# Altium schematic sheet test.SchDoc
size B
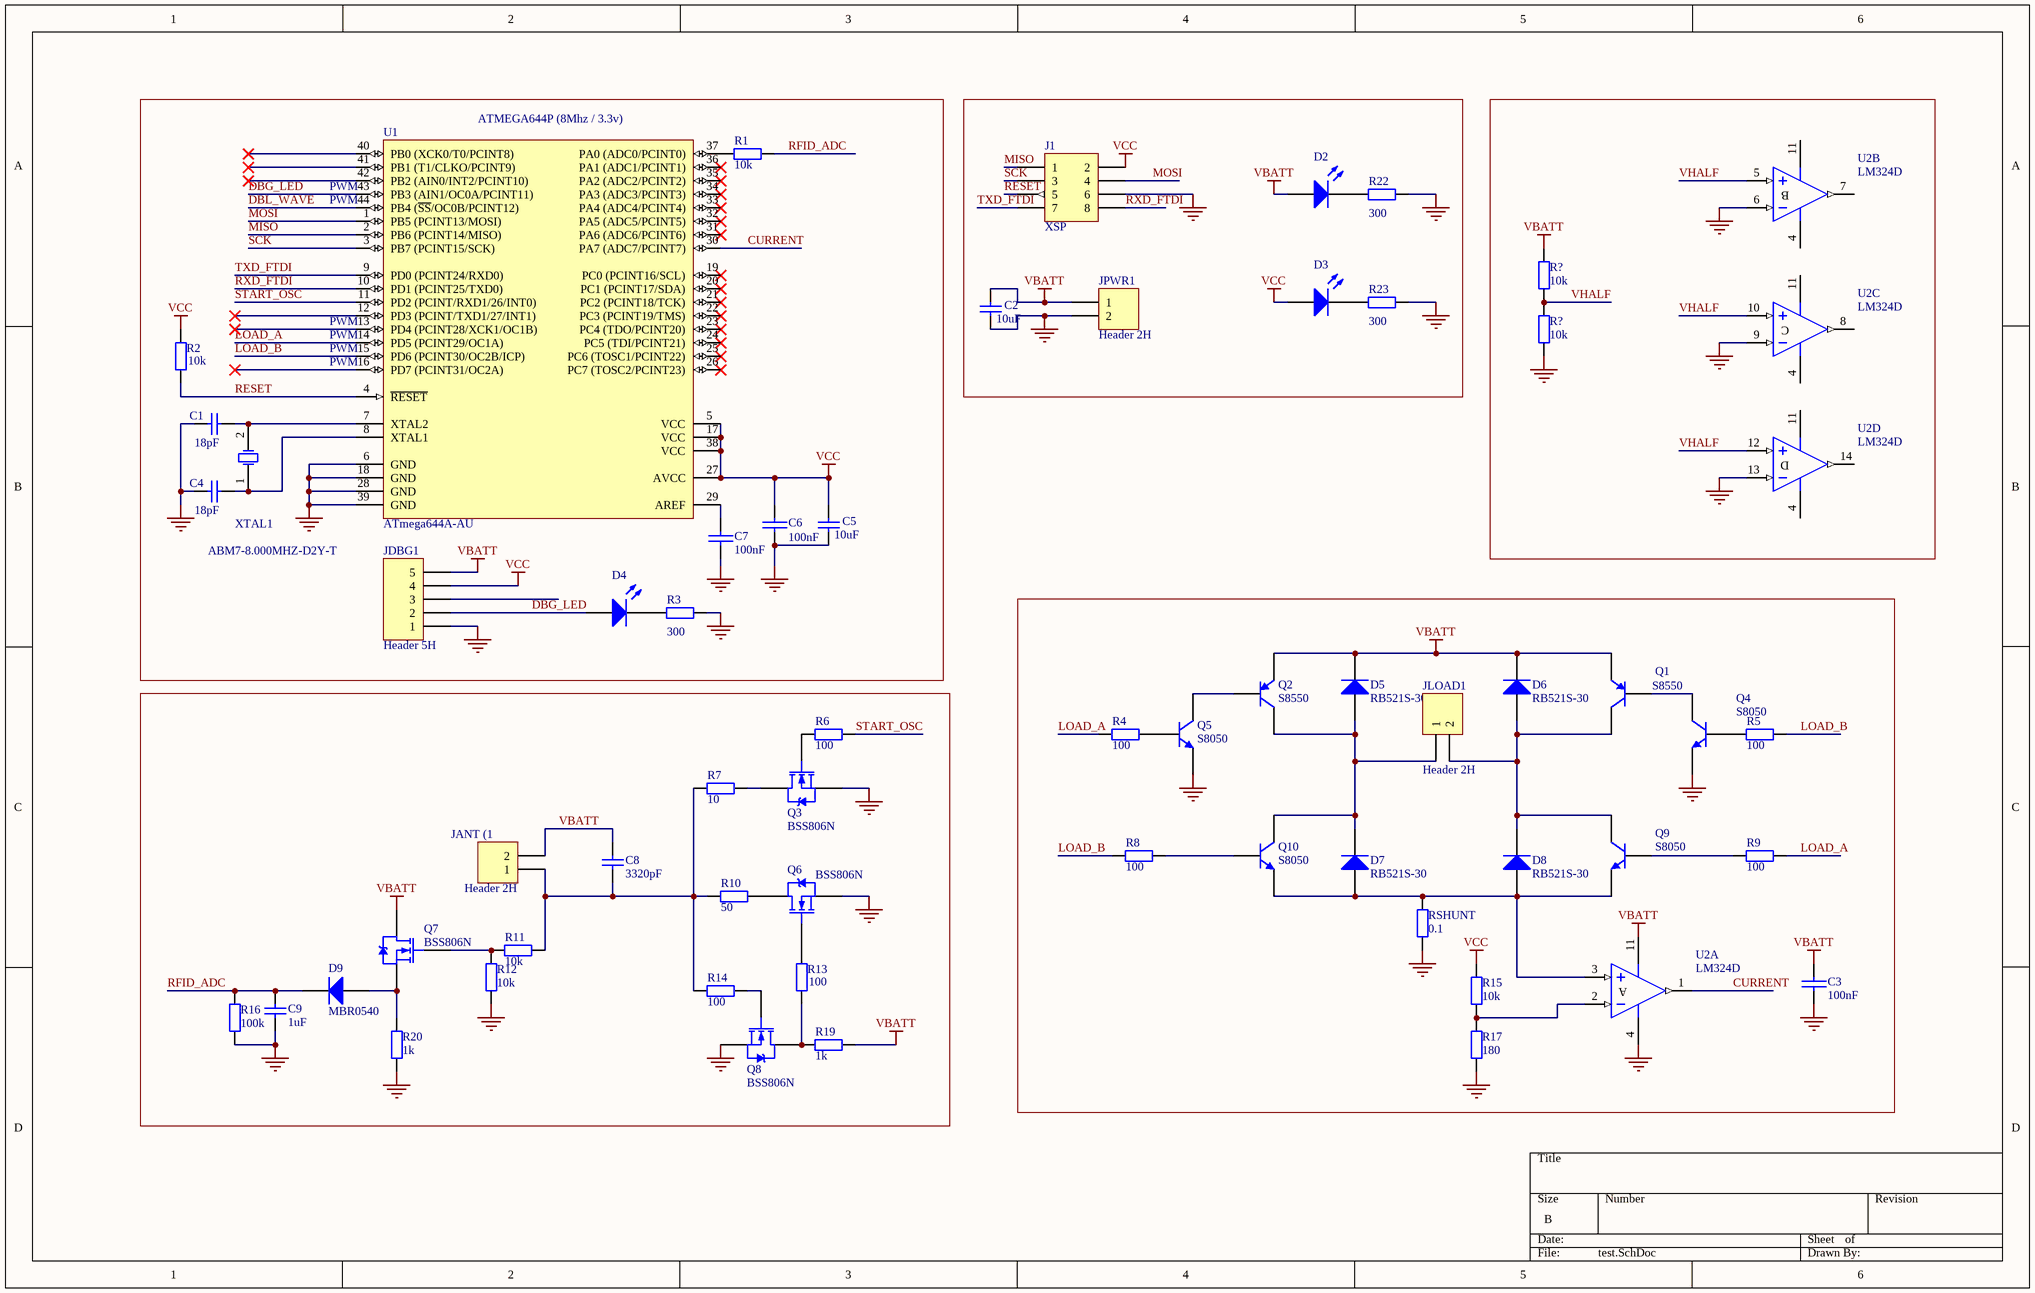
[diagram p0: test.SchDoc]

## Parts
(Parts that share a designator on the sheet are numbered #1, #2 ... from top to bottom, then left to right.)
C1  18pF  [CAPC1608N]
C2  10uF  [CAPC3216L]
C3  100nF  [CAPC1608N]
C4  18pF  [CAPC1608N]
C5  10uF  [CAPC3216L]
C6  100nF  [CAPC1608N]
C7  100nF  [CAPC1608N]
C8  3320pF  [CAPC1608N]
C9  1uF  [CAPC1608N]
D2  (no value)  [CAPC1608N]
D3  (no value)  [CAPC1608N]
D4  (no value)  [CAPC1608N]
D5  RB521S-30
D6  RB521S-30
D7  RB521S-30
D8  RB521S-30
D9  MBR0540  [SOD123/X.85]
J1  XSP  [HDR2X4H]
JANT_(1  Header 2H  [HDR1X2H]
JDBG1  Header 5H  [HDR1X5H]
JLOAD1  Header 2H  [HDR1X2H]
JPWR1  Header 2H  [HDR1X2H]
Q1  S8550  [BCY-W3/E4]
Q2  S8550  [BCY-W3/E4]
Q3  BSS806N  [BSS806N]
Q4  S8050  [BCY-W3/E4]
Q5  S8050  [BCY-W3/E4]
Q6  BSS806N  [BSS806N]
Q7  BSS806N  [BSS806N]
Q8  BSS806N  [BSS806N]
Q9  S8050  [BCY-W3/E4]
Q10  S8050  [BCY-W3/E4]
R1  10k  [RESC1608N]
R2  10k  [RESC1608N]
R3  300  [RESC1608N]
R4  100  [RESC1608N]
R5  100  [RESC1608N]
R6  100  [RESC1608N]
R7  10  [RESC1608N]
R8  100  [RESC1608N]
R9  100  [RESC1608N]
R10  50  [RESC1608N]
R11  10k  [RESC1608N]
R12  10k  [RESC1608N]
R13  100  [RESC1608N]
R14  100  [RESC1608N]
R15  10k  [RESC1608N]
R16  100k  [RESC1608N]
R17  180  [RESC1608N]
R19  1k  [RESC1608N]
R20  1k  [RESC1608N]
R22  300  [RESC1608N]
R23  300  [RESC1608N]
R?#1  10k  [RESC1608N]
R?#2  10k  [RESC1608N]
RSHUNT  0.1  [AXIAL-0.4]
U1  ATmega644A-AU  [44A_N]
U2  LM324D  [SO14_N]  (parts A,B,C,D of 4)
XTAL1  ABM7-8.000MHZ-D2Y-T  [XTAL]

## Nets
GND: C1.1 C2.1 C3.2 C4.1 C5.1 C6.2 C7.2 C9.1 J1.6 JDBG1.1 JPWR1.2 Q3.2(S) Q4.1(E) Q5.1(E) Q6.2(S) Q8.2(S) R3.2 R12.1 R16.1 R17.1 R20.1 R22.2 R23.2 R?#2.1 RSHUNT.1 U1.6(GND) U1.18(GND) U1.28(GND) U1.39(GND) U2.4(V+) U2.6(IN-) U2.9(IN-) U2.13(IN-)
VBATT: C2.2 C3.1 C8.2 D2.1(A) D5.1(K) D6.1(K) JANT_(1.2 JDBG1.5 JPWR1.1 Q1.1(E) Q2.1(E) Q7.3(D) R19.1 R?#1.2 U2.11(V-)
VCC: C5.2 C6.1 D3.1(A) J1.2 JDBG1.4 R2.1 R15.2 U1.5(VCC) U1.17(VCC) U1.27(AVCC) U1.38(VCC)
CURRENT: U1.30(PA7_(ADC7/PCINT7)) U2.1(OUT)
DBG_LED: D4.1(A) JDBG1.2 U1.43(PB3_(AIN1/OC0A/PCINT11))
DBL_WAVE: U1.44(PB4_(~{SS}/OC0B/PCINT12))
LOAD_A: R4.1 R9.2 U1.14(PD5_(PCINT29/OC1A))
LOAD_B: R5.2 R8.1 U1.15(PD6_(PCINT30/OC2B/ICP))
MISO: J1.1 U1.2(PB6_(PCINT14/MISO))
MOSI: J1.4 U1.1(PB5_(PCINT13/MOSI))
RESET: J1.5 R2.2 U1.4(~{RESET})
RFID_ADC: C9.2 D9.1(K) R1.1 R16.2
RXD_FTDI: J1.8 U1.10(PD1_(PCINT25/TXD0))
SCK: J1.3 U1.3(PB7_(PCINT15/SCK))
START_OSC: R6.2 U1.11(PD2_(PCINT/RXD1/26/INT0))
TXD_FTDI: J1.7 U1.9(PD0_(PCINT24/RXD0))
VHALF: R?#1.1 R?#2.2 U2.5(IN+) U2.10(IN+) U2.12(IN+)
NetC1_2: C1.2 U1.7(XTAL2) XTAL1.2(OSC2)
NetC4_2: C4.2 U1.8(XTAL1) XTAL1.1(OSC1)
NetC7_1: C7.1 U1.29(AREF)
NetC8_1: C8.1 JANT_(1.1 R7.1 R10.1 R11.2 R14.1
NetD2_2: D2.2(K) R22.1
NetD3_2: D3.2(K) R23.1
NetD4_2: D4.2(K) R3.1
NetD5_2: D5.2(A) D7.1(K) JLOAD1.1 Q2.3(C) Q10.3(C)
NetD6_2: D6.2(A) D8.1(K) JLOAD1.2 Q1.3(C) Q9.3(C)
NetD7_2: D7.2(A) D8.2(A) Q9.1(E) Q10.1(E) RSHUNT.2 U2.3(IN+)
NetD9_2: D9.2(A) Q7.2(S) R20.2
NetQ1_2: Q1.2(B) Q4.3(C)
NetQ2_2: Q2.2(B) Q5.3(C)
NetQ3_1: Q3.1(G) R6.1
NetQ3_3: Q3.3(D) R7.2
NetQ4_2: Q4.2(B) R5.1
NetQ5_2: Q5.2(B) R4.2
NetQ6_1: Q6.1(G) R13.1
NetQ6_3: Q6.3(D) R10.2
NetQ7_1: Q7.1(G) R11.1 R12.2
NetQ8_1: Q8.1(G) R14.2
NetQ8_3: Q8.3(D) R13.2 R19.2
NetQ9_2: Q9.2(B) R9.1
NetQ10_2: Q10.2(B) R8.2
NetR1_2: R1.2 U1.37(PA0_(ADC0/PCINT0))
NetR15_1: R15.1 R17.2 U2.2(IN-)

Not connected (* = marked no-connect by the designer): JDBG1 3; U1 12(PD3_(PCINT/TXD1/27/INT1))* 13(PD4_(PCINT28/XCK1/OC1B))* 16(PD7_(PCINT31/OC2A))* 19(PC0_(PCINT16/SCL))* 20(PC1_(PCINT17/SDA))* 21(PC2_(PCINT18/TCK))* 22(PC3_(PCINT19/TMS))* 23(PC4_(TDO/PCINT20))* 24(PC5_(TDI/PCINT21))* 25(PC6_(TOSC1/PCINT22))* 26(PC7_(TOSC2/PCINT23))* 31(PA6_(ADC6/PCINT6))* 32(PA5_(ADC5/PCINT5))* 33(PA4_(ADC4/PCINT4))* 34(PA3_(ADC3/PCINT3))* 35(PA2_(ADC2/PCINT2))* 36(PA1_(ADC1/PCINT1))* 40(PB0_(XCK0/T0/PCINT8))* 41(PB1_(T1/CLKO/PCINT9))* 42(PB2_(AIN0/INT2/PCINT10))*; U2 7(OUT) 8(OUT) 14(OUT)

## Notes on the sheet
- (near U1) ATMEGA644P (8Mhz / 3.3v)
- (near U1) PWM
- (in symbol LM324D, part A) A
- (in symbol LM324D, part B) B
- (in symbol LM324D, part C) C
- (in symbol LM324D, part D) D

## Library data of the parts
C1 C2 C4 C5 C8 C9 = Cap: Capacitor; Published: 8-Jun-2000; LatestRevisionDate: 17-Jul-2002; LatestRevisionNote: Re-released for DXP Platform.; PackageReference: RAD-0.3; Publisher: Altium Limited
  C1 C4: Value: 18pF
  C2 C5: PackageDescription: Radial Cap, Thru-Hole; 2 Leads; 0.3 in Pin Spacing; Value: 10uF
  C8: Value: 3320pF
  C9: Value: 1uF
C3 C6 C7 = CAP: Capacitor
D2-D4 = LED3: Typical BLUE SiC LED; Published: 8-Jun-2000; LatestRevisionDate: 17-Dec-2003; LatestRevisionNote: PCB Footprint replaced.; DatasheetVersion: 16-Apr-2002; PackageVersion: 16-Apr-2002; PackageReference: 3.5X2.8X1.9; Publisher: Altium Limited
D5-D9 = Diode: Default Diode; Published: 8-Jun-2000; LatestRevisionDate: 17-Jul-2002; LatestRevisionNote: Re-released for DXP Platform.; PackageVersion: Sep-1996; PackageReference: SMC; Publisher: Altium Limited; Code_JEDEC: DO-214-AB
J1 = Header 4X2H: Header, 4-Pin, Dual row, Right Angle; LatestRevisionDate: 17-Jul-2002; LatestRevisionNote: Re-released for DXP Platform.; Publisher: Altium Limited
JANT_(1 JLOAD1 JPWR1 = Header 2H: Header, 2-Pin, Right Angle; LatestRevisionDate: 17-Jul-2002; LatestRevisionNote: Re-released for DXP Platform.; Publisher: Altium Limited
JDBG1 = Header 5H: Header, 5-Pin, Right Angle; LatestRevisionDate: 17-Jul-2002; LatestRevisionNote: Re-released for DXP Platform.; Publisher: Altium Limited
Q1 Q2 = 2N3906: PNP General Purpose Amplifier; Published: 8-Jun-2000; LatestRevisionDate: 15-Jan-2003; LatestRevisionNote: PCB Footprint 'BCY-W3/D4.7' replaced; DatasheetVersion: 1997; PackageVersion: Sep-1998; PackageReference: TO-92A; Publisher: Altium Limited; Code_JEDEC: TO-92A; ComponentLink1Description: Manufacturer Link; ComponentLink1URL: http://www.fairchildsemi.com/; ComponentLink2Description: Datasheet; ComponentLink2URL: http://www.fairchildsemi.com/ds/2N%2F2N3906.pdf
Q4 Q5 Q9 Q10 = 2N3904: NPN General Purpose Amplifier; Published: 8-Jun-2000; LatestRevisionDate: 15-Jan-2003; LatestRevisionNote: PCB Footprint 'BCY-W3/D4.7' replaced; DatasheetVersion: 1997; PackageVersion: Sep-1998; PackageReference: TO-92A; Publisher: Altium Limited; Code_JEDEC: TO-92A; ComponentLink1Description: Manufacturer Link; ComponentLink1URL: http://www.fairchildsemi.com/; ComponentLink2Description: Datasheet; ComponentLink2URL: http://www.fairchildsemi.com/ds/2N%2F2N3904.pdf
R1-R17 R19 R20 R22 R23 R?#1 R?#2 RSHUNT = Res2: Resistor; Published: 8-Jun-2000; LatestRevisionDate: 17-Jul-2002; LatestRevisionNote: Re-released for DXP Platform.; PackageReference: AXIAL-0.4; Publisher: Altium Limited
  R1 R2 R11 R12 R15 R?#1 R?#2: Value: 10k
  R3 R22 R23: Value: 300
  R4-R6 R8 R9 R13 R14: Value: 100
  R7: Value: 10
  R10: Value: 50
  R16: Value: 100k
  R17: Value: 180
  R19 R20: Value: 1k
  RSHUNT: Value: 0.1
U1 = ATmega644A-AU: 8-bit AVR Microcontroller, 64KB Flash, 2KB EEPROM, 4KB SRAM, 44-pin TQFP, Industrial Grade (-40°C to 85°C); Published: 1-Apr-2010; DatasheetVersion: revA, Jan-2010; PackageVersion: rev.B, Oct-2001; PackageReference: 44A; Publisher: Altium Limited; PackageDescription: 44-Pin Plastic Thin Profile Quad Flat Pack, 10 x 10 x 1.0 mm Body, 0.8 mm Pitch (TQFP); Supplier 1: Digi-Key; Supplier Part Number 1: ATMEGA644A-AU-ND; Supplier 2: Mouser; Supplier Part Number 2: 556-ATMEGA644A-AU; ComponentLink1Description: Manufacturer Link; ComponentLink1URL: http://www.atmel.com/products/avr/default.asp?; ComponentLink2Description: ATmega164A/164PA/324A/324PA/644A/644PA/1284/1284P Datasheet; ComponentLink2URL: http://www.atmel.com/dyn/resources/prod_documents/doc8272.pdf; ComponentLink3Description: ATmega164A/164PA/324A/324PA/644A/644PA/1284/1284P Summary; ComponentLink3URL: http://www.atmel.com/dyn/resources/prod_documents/8272S.pdf; ComponentLink4Description: Atmel.com Home; ComponentLink4URL: http://www.atmel.com
U2 = LM324D: Low-Power Quad Operational Amplifier; Published: 24-Aug-2001; LatestRevisionDate: 13-Apr-2006; LatestRevisionNote: IPC-7351 Footprint Added.; DatasheetVersion: Jun-1999; PackageVersion: Sep-1998; PackageReference: SO14; Publisher: Altium Limited; PackageDescription: 14-Pin Small Outline Integrated Circuit 1.27 mm Pitch; Code_IPC: SOIC127P600-14; ComponentLink1Description: Manufacturer Link; ComponentLink1URL: http://www.st.com/; ComponentLink2Description: Datasheet; ComponentLink2URL: http://www.st.com/stonline/products/literature/ds/2156/lm324.pdf